# EAGLE design Sensor_Board_2.03_HX711_DS18b2 (EAGLE 9.6.2)
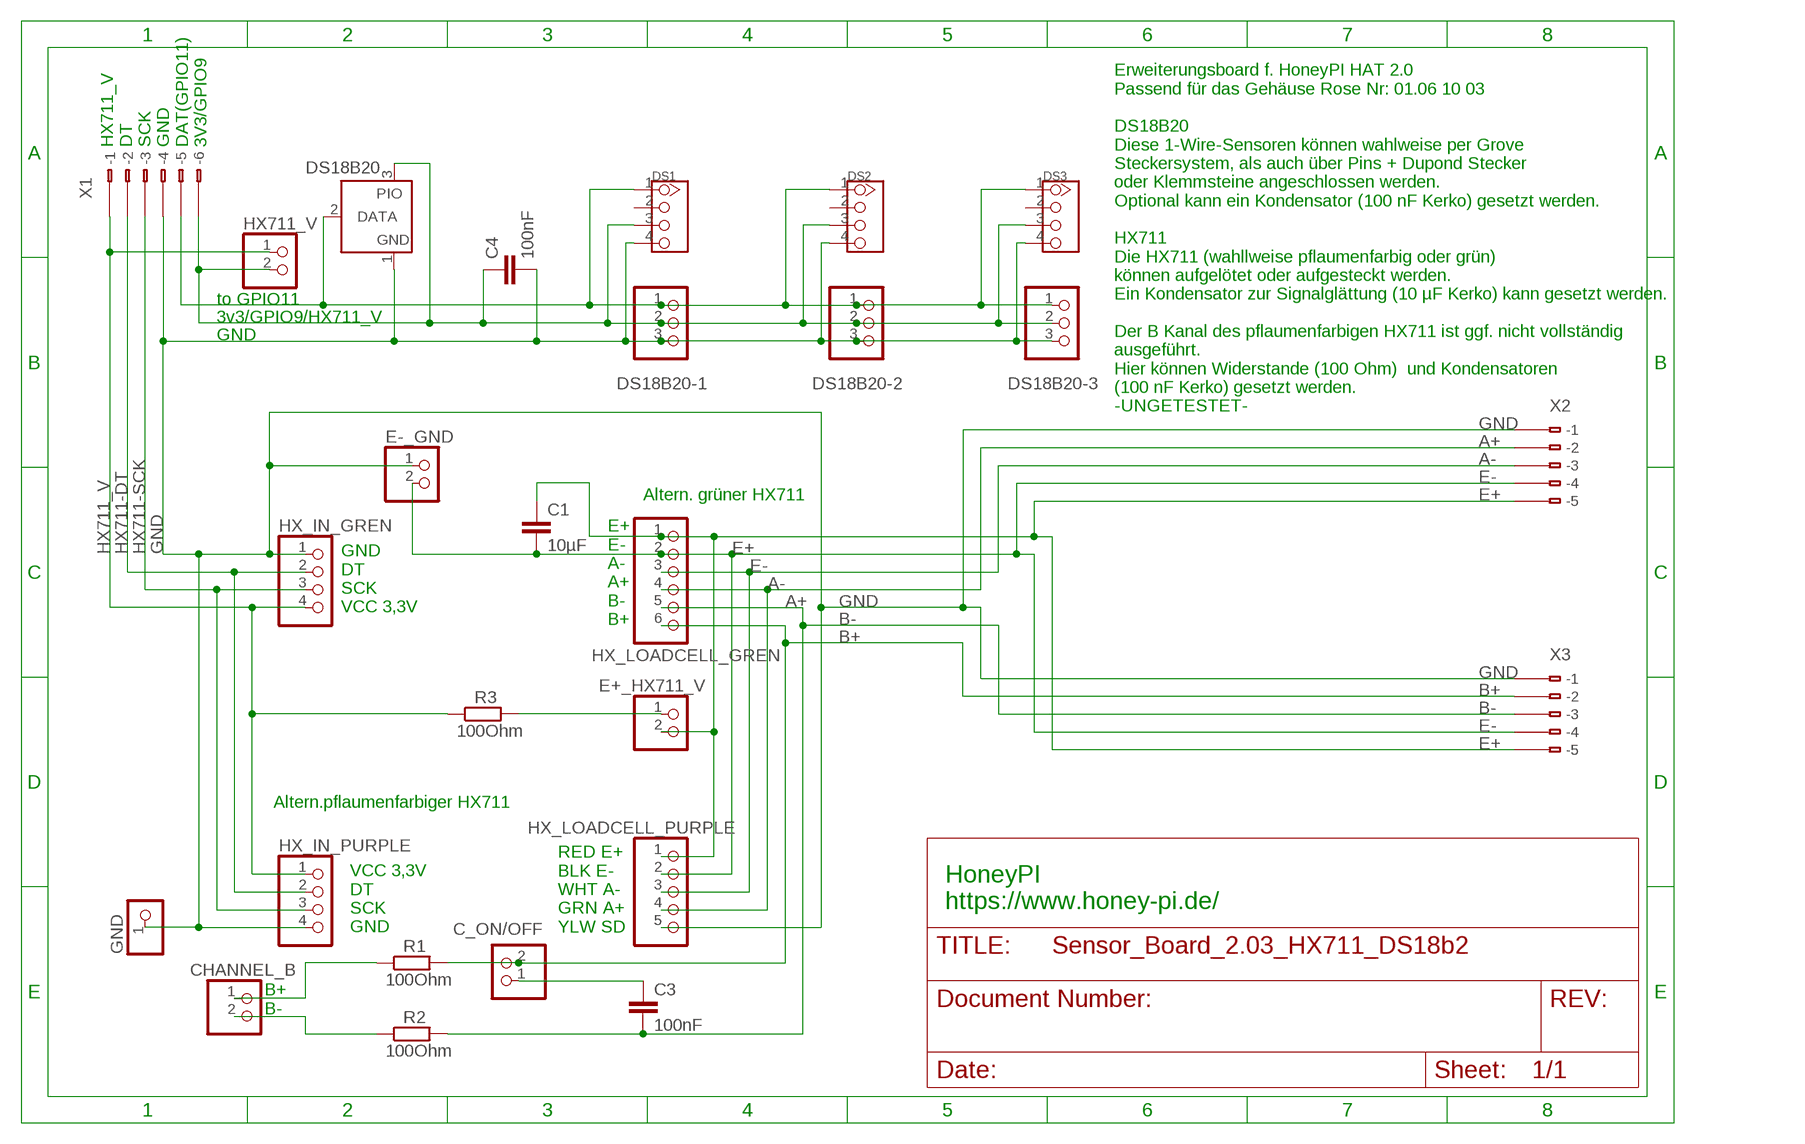
[diagram p0: schematic, sheet 1]

## Parts
C1  10µF  C5/2.5  [C5B2.5]
C3  100nF  C5/2.5  [C5B2.5]
C4  100nF  C5/2.5  [C5B2.5]
C_ON/OFF  PINHD-1X2  [1X02]
CHANNEL_B  PINHD-1X2  [1X02]
DS1  TWIG-4P-2.0-2.0  [4P-2.0]
DS2  TWIG-4P-2.0-2.0  [4P-2.0]
DS3  TWIG-4P-2.0-2.0  [4P-2.0]
DS18B20  DS2405  [TO92-]
DS18B20-1  PINHD-1X3  [1X03]
DS18B20-2  PINHD-1X3  [1X03]
DS18B20-3  PINHD-1X3  [1X03]
E+_HX711_V  PINHD-1X2  [1X02]
E-_GND  PINHD-1X2  [1X02]
GND  PINHD-1X1  [1X01]
HX711_V  PINHD-1X2  [1X02]
HX_IN_GREN  PINHD-1X4  [1X04]
HX_IN_PURPLE  PINHD-1X4  [1X04]
HX_LOADCELL_GREN  PINHD-1X6  [1X06]
HX_LOADCELL_PURPLE  PINHD-1X5  [1X05]
R1  100Ohm  R-EU_0207/10  [0207/10]
R2  100Ohm  R-EU_0207/10  [0207/10]
R3  100Ohm  R-EU_0207/10  [0207/10]
X1  233-506  [233-506]
X2  233-505  [233-505]
X3  233-505  [233-505]

## Nets
3V3 [Supply3v3]: C4.1 DS1.3 DS2.3 DS3.3 DS18B20-1.2 DS18B20-2.2 DS18B20-3.2 DS18B20.3(PIO) HX711_V.2 X1.B6(B-6)
A+: HX_LOADCELL_GREN.4 HX_LOADCELL_PURPLE.4 X2.B2(B-2)
A-: HX_LOADCELL_GREN.3 HX_LOADCELL_PURPLE.3 X2.B3(B-3)
B+: C_ON/OFF.2 HX_LOADCELL_GREN.6 R1.2 X3.B2(B-2)
B-: C3.2 HX_LOADCELL_GREN.5 R2.2 X3.B3(B-3)
DS18B20_DATA_GPIO11_PIN23: DS1.1 DS2.1 DS3.1 DS18B20-1.1 DS18B20-2.1 DS18B20-3.1 DS18B20.2(DATA) X1.B5(B-5)
E+ [Supply5v]: C1.1 E+_HX711_V.2 HX_LOADCELL_GREN.1 HX_LOADCELL_PURPLE.1 X2.B5(B-5) X3.B5(B-5)
E-: C1.2 E-_GND.2 HX_LOADCELL_GREN.2 HX_LOADCELL_PURPLE.2 X2.B4(B-4) X3.B4(B-4)
GND [Supply5v]: C4.2 DS1.4 DS2.4 DS3.4 DS18B20-1.3 DS18B20-2.3 DS18B20-3.3 DS18B20.1(GND) E-_GND.1 GND.1 HX_IN_GREN.1 HX_IN_PURPLE.4 HX_LOADCELL_PURPLE.5 X1.B4(B-4) X2.B1(B-1) X3.B1(B-1)
HX711-DT: HX_IN_GREN.2 HX_IN_PURPLE.2 X1.B2(B-2)
HX711-SCK: HX_IN_GREN.3 HX_IN_PURPLE.3 X1.B3(B-3)
HX711_V [Supply3v3]: HX711_V.1 HX_IN_GREN.4 HX_IN_PURPLE.1 R3.1 X1.B1(B-1)
N$1: CHANNEL_B.1 R1.1
N$2: CHANNEL_B.2 R2.1
N$3: C3.1 C_ON/OFF.1
N$4: E+_HX711_V.1 R3.2
Unconnected: DS1.2 DS2.2 DS3.2 X1.A1(-1) X1.A2(-2) X1.A3(-3) X1.A4(-4) X1.A5(-5) X1.A6(-6) X2.A1(-1) X2.A2(-2) X2.A3(-3) X2.A4(-4) X2.A5(-5) X3.A1(-1) X3.A2(-2) X3.A3(-3) X3.A4(-4) X3.A5(-5)

## Notes on the sheet
- HX711_V
  DT
  SCK
  GND
  DAT(GPIO11)
  3V3/GPIO9
- to GPIO11
- 3v3/GPIO9/HX711_V
- GND
- Erweiterungsboard f. HoneyPI HAT 2.0
  Passend für das Gehäuse Rose Nr: 01.06 10 03 
  
  DS18B20
  Diese 1-Wire-Sensoren können wahlweise per Grove
  Steckersystem, als auch über Pins + Dupond Stecker
  oder Klemmsteine angeschlossen werden.
  Optional kann ein Kondensator (100 nF Kerko) gesetzt werden. 
  
  HX711
  Die HX711 (wahllweise pflaumenfarbig oder grün)
  können aufgelötet oder aufgesteckt werden.
  Ein Kondensator zur Signalglättung (10 µF Kerko) kann gesetzt werden.
  
  Der B Kanal des pflaumenfarbigen HX711 ist ggf. nicht vollständig
  ausgeführt.
  Hier können Widerstande (100 Ohm)  und Kondensatoren
  (100 nF Kerko) gesetzt werden.
  -UNGETESTET-
- Altern. grüner HX711
- GND
  DT
  SCK
  VCC 3,3V
- E+
  E-
  A-
  A+
  B-
  B+
- Altern.pflaumenfarbiger HX711
- HoneyPI
  https://www.honey-pi.de/
- VCC 3,3V
  DT
  SCK
  GND
- RED E+
  BLK E-
  WHT A-
  GRN A+
  YLW SD
- B+
  B-

## Library data of the parts
C1 C3 C4 = capacitor-wima:C: CAPACITOR naming: grid - package width
C_ON/OFF CHANNEL_B E+_HX711_V E-_GND HX711_V = pinhead:PINHD-1X2: PIN HEADER
DS1-DS3 = Connector:TWIG-4P-2.0
DS18B20 = maxim:DS2405: Addressable Switch DALLAS Semiconductor; MF: DALLAS SEMICONDUCTOR; MPN: DS2405; OC_FARNELL: 1188025; OC_NEWARK: 06F4645
DS18B20-1-DS18B20-3 = pinhead:PINHD-1X3: PIN HEADER
GND = pinhead:PINHD-1X1: PIN HEADER
HX_IN_GREN HX_IN_PURPLE = pinhead:PINHD-1X4: PIN HEADER
HX_LOADCELL_GREN = pinhead:PINHD-1X6: PIN HEADER
HX_LOADCELL_PURPLE = pinhead:PINHD-1X5: PIN HEADER
R1-R3 = rcl:R-EU_: RESISTOR, European symbol; SPICEPREFIX: R
X1 = con-wago:233-506: WAGO Cage Clamp; MF: Wago Corporation; MPN: 0233-0506; OC_FARNELL: 1777100; OC_NEWARK: 79K2052
X2 X3 = con-wago:233-505: WAGO Cage Clamp; MF: Wago Corporation; MPN: 0233-0505; OC_FARNELL: unknown; OC_NEWARK: 79K2051

## Net classes
0 Signal: width 0.152 mm, clearance 0.305 mm
1 Supply3v3: width 0.203 mm, clearance 0.305 mm
2 Supply5v: width 0.406 mm, clearance 0.305 mm

## Board
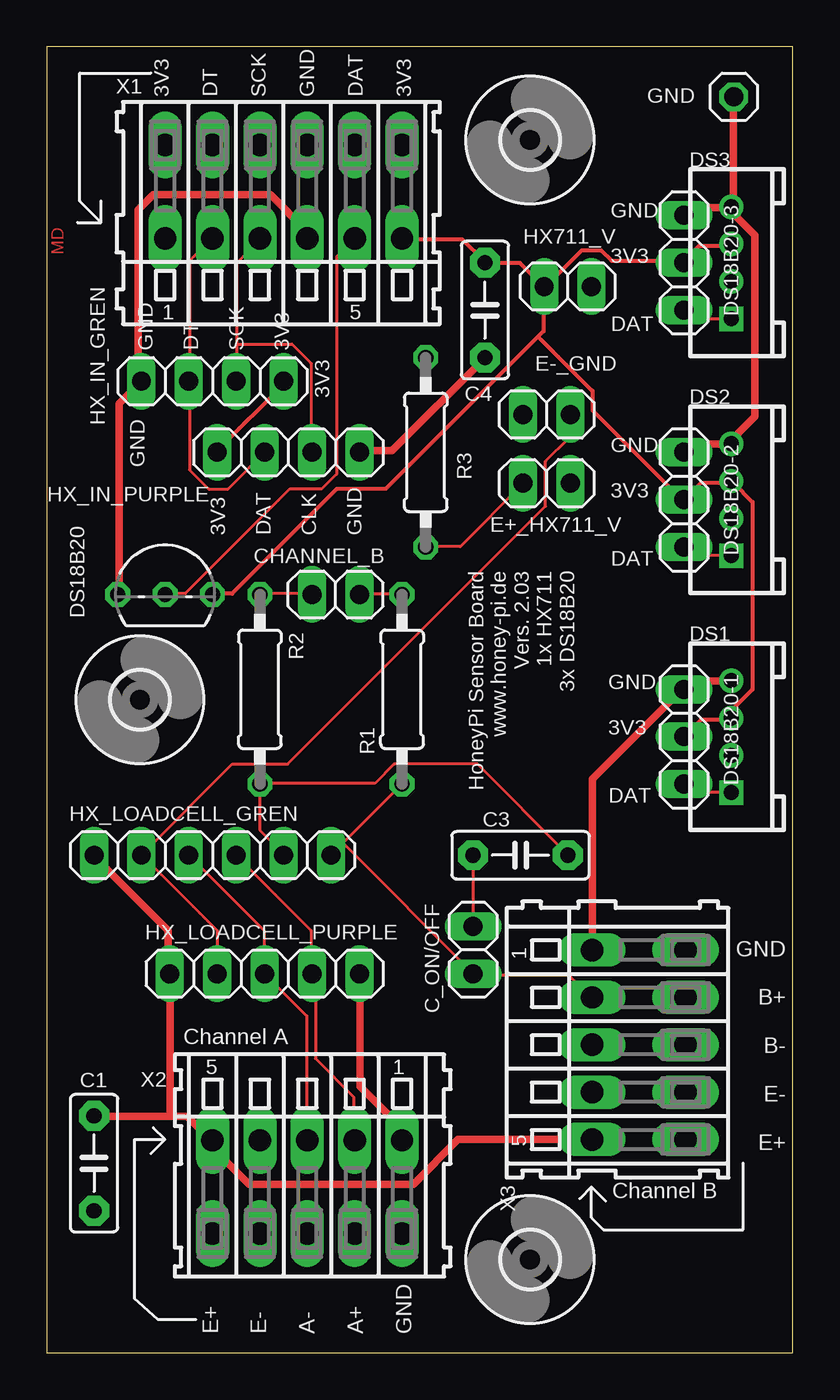
[diagram p1: board, top side]
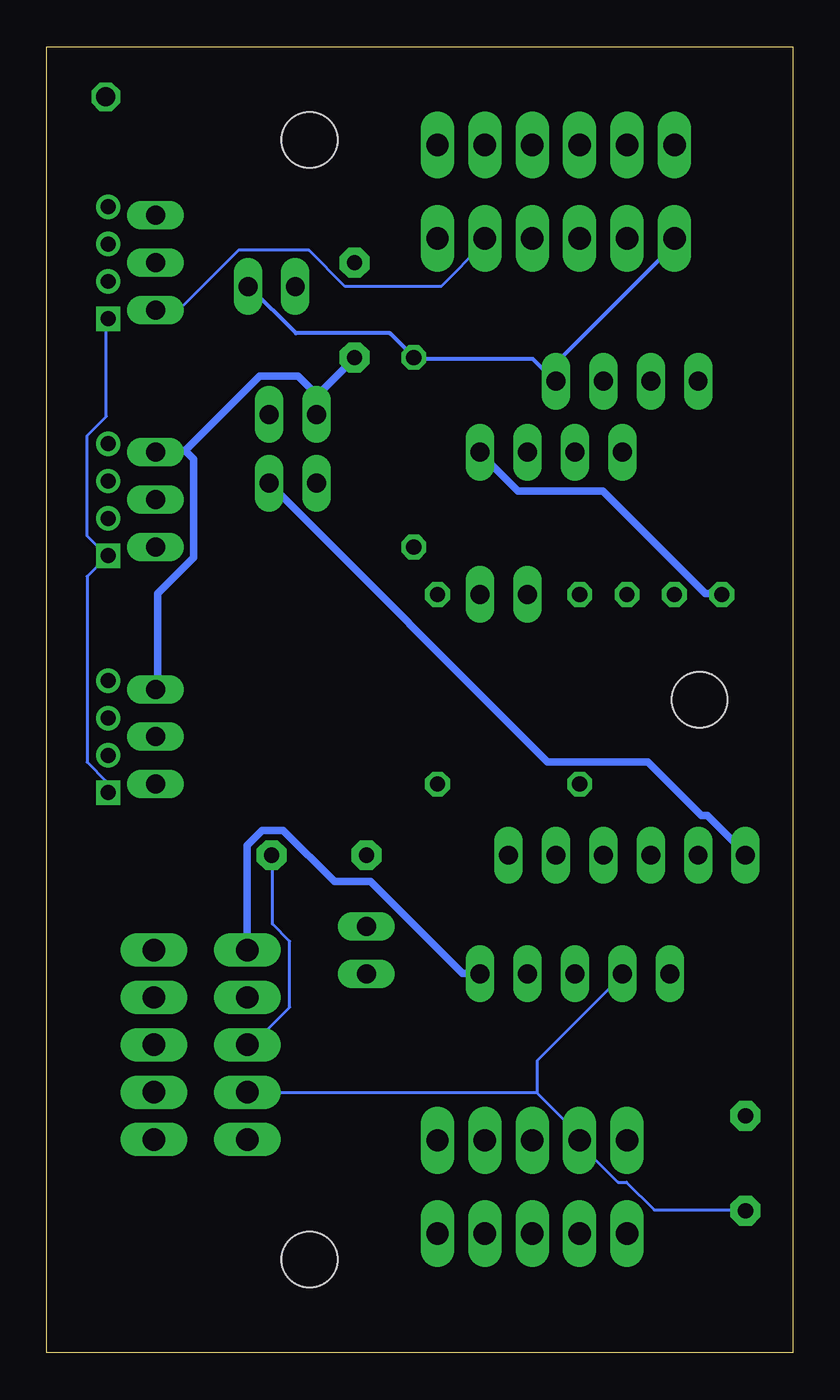
[diagram p2: board, bottom side, seen from below]

Size 40 x 70 mm. Coordinates in mm from the lower left corner, seen from the top.
Outline: 0,0 40,0 40,70 0,70 0,0
Copper layers (1*16): Top 0.035mm / dielectric 1.5mm / Bottom 0.035mm
Design rules "default *": minimum track width 6mil, minimum drill 0.35mm, track to track 6mil, track to pad 6mil, pad to pad 6mil, via to via 6mil, smd to smd 6mil, copper to edge 40mil, drill to drill 1mm, minimum pad ring 10mil, minimum via ring 8mil, stop-mask expansion 4mil, vias tented up to drill 0mil, thermal gap 10mil

### Footprints (pad centres in the part's own frame; a part is rotated, then mirrored left to right if it is on the bottom)
C5B2.5 = drill 0.813 pad 1.6 octagon: 1 -2.54,0; 2 2.54,0
1X02 = drill 1.016 long: 1 -1.27,0; 2 1.27,0
4P-2.0 = drill 0.8 pad 1.27 square: 1 -3,0 | drill 0.8 pad 1.27: 2 -1,0; 3 1,0; 4 3,0
TO92- = drill 0.813 octagon: 1 -2.54,0; 2 0,0; 3 2.54,0
1X03 = drill 1.016 long: 1 -2.54,0; 2 0,0; 3 2.54,0
1X01 = drill 1.016 octagon: 1 0,0
1X04 = drill 1.016 long: 1 -3.81,0; 2 -1.27,0; 3 1.27,0; 4 3.81,0
1X06 = drill 1.016 long: 1 -6.35,0; 2 -3.81,0; 3 -1.27,0; 4 1.27,0; 5 3.81,0; 6 6.35,0
1X05 = drill 1.016 long: 1 -5.08,0; 2 -2.54,0; 3 0,0; 4 2.54,0; 5 5.08,0
0207/10 = drill 0.813 octagon: 1 -5.08,0; 2 5.08,0
3,0 = hole 3: 0,0
233-506 = drill 1.2 long: A1 -6.35,2.5; A2 -3.81,2.5; A3 -1.27,2.5; A4 1.27,2.5; A5 3.81,2.5; A6 6.35,2.5; B1 -6.35,-2.5; B2 -3.81,-2.5; B3 -1.27,-2.5; B4 1.27,-2.5; B5 3.81,-2.5; B6 6.35,-2.5
233-505 = drill 1.2 long: A1 -5.08,2.5; A2 -2.54,2.5; A3 0,2.5; A4 2.54,2.5; A5 5.08,2.5; B1 -5.08,-2.5; B2 -2.54,-2.5; B3 0,-2.5; B4 2.54,-2.5; B5 5.08,-2.5

### Placement (x,y rotation side)
C1  2.54,10.16 270 top
C3  25.4,26.67 0 top
C4  23.5,55.88 270 top
C_ON/OFF  22.86,21.59 270 top
CHANNEL_B  15.49,40.64 180 top
DS1  36.7,33.02 90 top
DS2  36.7,45.72 90 top
DS3  36.7,58.42 90 top
DS18B20  6.35,40.64 0 top
DS18B20-1  34.16,33.02 90 top
DS18B20-2  34.16,45.72 90 top
DS18B20-3  34.16,58.42 90 top
E+_HX711_V  26.8,46.61 0 top
E-_GND  26.8,50.29 0 top
GND  36.83,67.31 0 top
HX711_V  27.94,57.15 180 top
HX_IN_GREN  8.89,52.07 0 top
HX_IN_PURPLE  12.95,48.26 0 top
HX_LOADCELL_GREN  8.89,26.67 0 top
HX_LOADCELL_PURPLE  11.68,20.32 0 top
R1  19.05,35.56 270 top
R2  11.43,35.56 270 top
R3  20.32,48.26 270 top
U$1  [3,0]  25.91,5 0 top
U$2  [3,0]  25.91,65 0 top
U$5  [3,0]  5,35 0 top
X1  12.7,62.23 0 top
X2  13.97,8.89 180 top
X3  31.75,16.51 270 top

### Tracks (layer width: path | path; a pad name or v marks a point on that pad's centre or on a via)
3V3
  Top 0.203: DS18B20-1.2 35.09,33.95 36.69,33.95 DS1.3 36.8,34.06 36.8,34.52 37.83,35.55 37.83,45.61 36.8,46.63 DS2.3 36.69,46.63 35.09,46.63 34.18,45.72 DS18B20-2.2 34.06,45.72 29.26,50.52 29.26,51.55 26.35,54.46 | DS3.3 36.69,59.32 34.98,59.32 34.18,58.52 DS18B20-3.2 34.06,58.52 30.29,58.52 29.72,59.09 28.69,59.09 26.75,57.15 HX711_V.2 26.63,57.15 | 26.35,54.46 26.63,54.75 26.63,57.15 | 26.35,54.46 18.17,46.29 15.54,46.29 9.94,40.69 8.91,40.69 DS18B20.3 | 26.63,57.15 25.38,58.41 23.55,58.41 C4.1 23.43,58.52 22.29,59.66 19.09,59.66 X1.B6
A+
  Top 0.152: HX_LOADCELL_GREN.4 10.17,26.63 14.17,22.63 14.17,20.34 HX_LOADCELL_PURPLE.4 14.29,20.23 14.4,20.12 14.4,15.77 16.46,13.72 16.46,11.43 X2.B2
A-
  Top 0.152: HX_LOADCELL_GREN.3 11.66,22.63 11.66,20.34 HX_LOADCELL_PURPLE.3 13.95,18.06 13.95,11.43 X2.B3
B+
  Top 0.152: HX_LOADCELL_GREN.6 15.89,27.32 | 15.89,27.32 R1.2 | X3.B2 29.15,19.09 28,20.23 22.86,20.23 C_ON/OFF.2 22.86,20.34 15.89,27.32
B-
  Top 0.152: HX_LOADCELL_GREN.5 12.69,26.75 11.43,28 R2.2 11.43,30.52 17.6,30.52 18.63,31.55 23.09,31.55 27.89,26.75 C3.2
  Bottom 0.152: C3.2 27.89,26.63 27.89,22.97 26.98,22.06 26.98,18.52 28.92,16.57 29.15,16.57 X3.B3
DS18B20_DATA_GPIO11_PIN23
  Top 0.152: DS3.1 36.69,55.44 34.52,55.44 34.18,55.78 DS18B20-3.1 | DS1.1 36.69,30.06 34.52,30.06 34.18,30.4 DS18B20-1.1 | DS2.1 36.69,42.75 34.52,42.75 34.18,43.09 DS18B20-2.1 | DS18B20.2 6.4,40.69 7.43,40.69 13.03,46.29 14.74,46.29 15.54,47.09 15.54,58.75 16.46,59.66 X1.B5
  Bottom 0.152: DS1.1 36.8,30.06 36.8,30.63 37.83,31.66 37.83,41.6 36.8,42.63 DS2.1 36.8,42.75 37.83,43.78 37.83,49.15 36.8,50.18 36.8,55.32 DS3.1 | DS18B20-3.1 34.06,55.89 32.92,55.89 29.72,59.09 25.95,59.09 24,57.15 18.86,57.15 16.57,59.44 16.57,59.66 X1.B5
E+
  Top 0.406: 6.63,12.69 7.54,12.69 8.8,11.43 X2.B5 8.91,11.2 8.91,10.97 10.86,9.03 19.66,9.03 22.06,11.43 X3.B5 | 6.63,12.69 2.63,12.69 C1.1 | HX_LOADCELL_GREN.1 2.52,26.63 6.51,22.63 6.51,20.34 HX_LOADCELL_PURPLE.1 6.63,20.12 6.63,12.69
  Bottom 0.406: E+_HX711_V.2 28,46.52 13.14,31.66 7.77,31.66 4.92,28.8 4.57,28.8 2.52,26.75 HX_LOADCELL_GREN.1
E-
  Top 0.152: HX_LOADCELL_PURPLE.2 9.14,22.63 5.14,26.63 HX_LOADCELL_GREN.2 5.14,26.75 9.94,31.55 12.92,31.55 26.75,45.38 26.75,47.78 28,49.03 28,50.29 E-_GND.2
  Bottom 0.152: C1.2 2.63,7.66 7.43,7.66 8.91,9.14 9.37,9.14 11.43,11.2 X2.B4 11.43,11.66 13.72,13.95 | 13.72,13.95 29.15,13.95 X3.B4 | 13.72,13.95 13.72,15.66 9.14,20.23 HX_LOADCELL_PURPLE.2
GND
  Top 0.406: HX_LOADCELL_PURPLE.5 16.8,20.23 16.8,14.29 18.97,12.12 18.97,11.43 X2.B1 | DS1.4 36.69,36.01 34.52,36.01 34.18,35.66 DS18B20-1.3 34.06,35.55 29.26,30.75 29.26,21.6 X3.B1 | DS18B20.1 3.89,40.69 3.89,50.86 5.03,52.01 HX_IN_GREN.1 4.92,52.12 4.92,61.27 5.71,62.06 12,62.06 13.95,60.12 13.95,59.78 X1.B4 | DS3.4 36.69,61.38 34.52,61.38 34.18,61.04 DS18B20-3.3 | GND.1 36.8,67.21 36.8,61.49 DS3.4 | DS18B20-2.3 34.18,48.35 34.52,48.69 36.69,48.69 DS2.4 36.69,48.92 37.95,50.18 37.95,59.89 36.8,61.04 36.8,61.27 DS3.4 | HX_IN_PURPLE.4 16.8,48.35 18.52,48.35 23.43,53.26 C4.2
  Bottom 0.406: HX_LOADCELL_PURPLE.5 16.8,20.34 17.72,20.34 22.63,25.26 24.57,25.26 27.32,28 28.46,28 29.26,27.2 29.26,21.6 X3.B1 | C4.2 23.55,53.26 25.49,51.32 25.49,50.29 E-_GND.1 25.6,51.44 26.52,52.35 28.57,52.35 32.58,48.35 | 32.58,48.35 34.06,48.35 DS18B20-2.3 | DS18B20.1 3.89,40.69 4.69,40.69 10.17,46.18 14.74,46.18 16.8,48.23 HX_IN_PURPLE.4 | 32.58,48.35 32.12,47.89 32.12,42.63 34.06,40.69 34.06,35.66 DS18B20-1.3
HX711-DT
  Top 0.152: X1.B2 8.8,59.66 7.66,58.52 7.66,52.12 HX_IN_GREN.2 7.66,52.01 7.66,47.32 8.69,46.29 9.72,46.29 HX_IN_PURPLE.2
HX711-SCK
  Top 0.152: 10.17,54.06 10.17,58.41 11.43,59.66 X1.B3 | 10.17,54.06 10.17,52.12 HX_IN_GREN.3 | 10.17,54.06 13.14,54.06 14.17,53.03 14.17,48.35 HX_IN_PURPLE.3
HX711_V
  Top 0.203: HX_IN_PURPLE.1 9.14,48.35 12.8,52.01 HX_IN_GREN.4
  Bottom 0.203: HX711_V.1 29.15,57.15 26.63,54.63 21.6,54.63 20.34,53.38 R3.1 20.23,53.26 13.95,53.26 12.8,52.12 HX_IN_GREN.4 13.14,52.58 6.4,59.32 6.4,59.66 X1.B1
N$1
  Top 0.152: R1.1 18.97,40.69 16.8,40.69 CHANNEL_B.1
N$2
  Top 0.152: R2.1 11.43,40.69 14.17,40.69 CHANNEL_B.2
N$3
  Top 0.152: C3.1 C_ON/OFF.1
N$4
  Top 0.152: R3.2 20.34,43.2 22.17,43.2 25.49,46.52 E+_HX711_V.1

### Text on the board
Top: MD
tNames: 3V3 / / DT / / SCK / / GND / / DAT / / 3V3 | GND / / 3V3 / / / DAT | GND / / DT / / SCK / / 3V3 | 3V3 | GND | 3V3 / / DAT / / CLK / / GND | HoneyPi Sensor Board / www.honey-pi.de / Vers. 2.03 / 1x HX711 / 3x DS18B20 | GND / / 3V3 / / / DAT | GND / / 3V3 / / / DAT | GND / / B+ / / B- / / E- / / E+ | Channel A | Channel B | E+ / / E- / / A- / / A+ / / GND